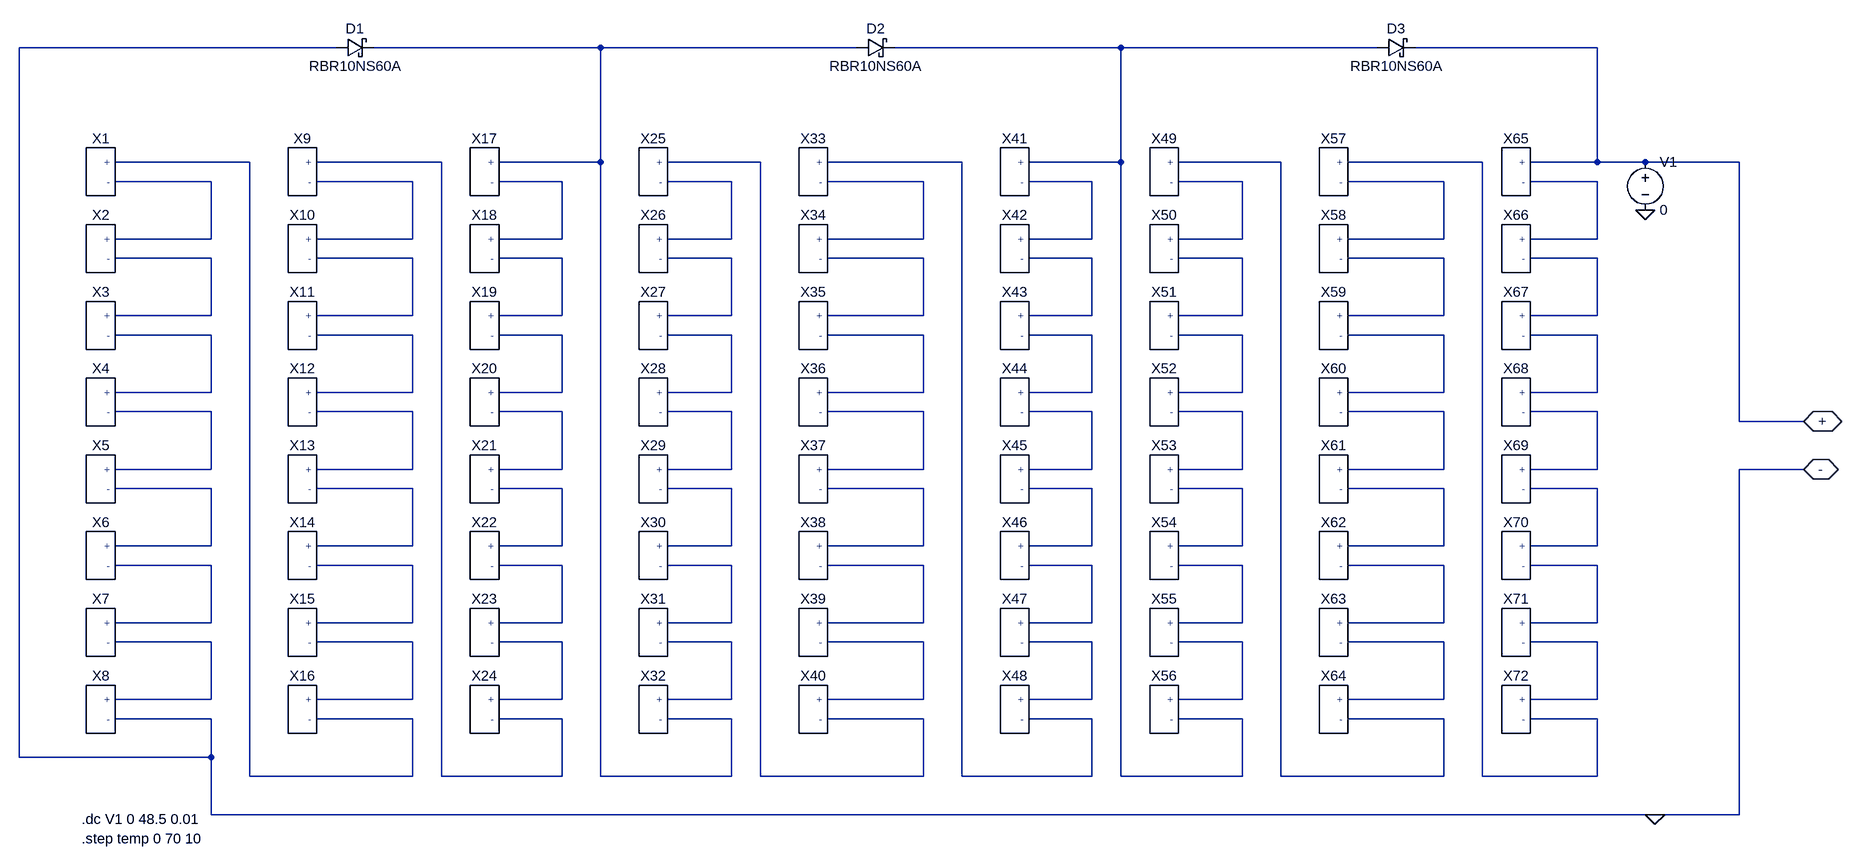
[diagram p0: schematic 24_09_10_Bomen_Module_no_shaded.asc]
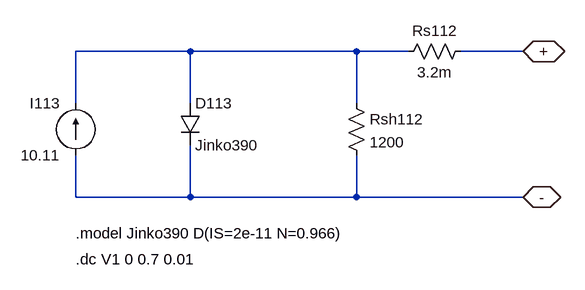
[diagram p1: sub-circuit 24_09_10_bomen_cell.asc]
24_09_10_Bomen_Module_no_shaded.asc, the LTspice schematic file:
Version 4.1
SHEET 1 3316 1452
WIRE 496 -64 -32 -64
WIRE 992 -64 560 -64
WIRE 1472 -64 992 -64
WIRE 1968 -64 1536 -64
WIRE 2448 -64 1968 -64
WIRE 2864 -64 2512 -64
WIRE 352 144 128 144
WIRE 672 144 464 144
WIRE 992 144 992 -64
WIRE 992 144 768 144
WIRE 1312 144 1104 144
WIRE 1648 144 1424 144
WIRE 1968 144 1968 -64
WIRE 1968 144 1760 144
WIRE 2288 144 2064 144
WIRE 2624 144 2400 144
WIRE 2864 144 2864 -64
WIRE 2864 144 2704 144
WIRE 2944 144 2864 144
WIRE 3104 144 2944 144
WIRE 288 176 128 176
WIRE 624 176 464 176
WIRE 928 176 768 176
WIRE 1264 176 1104 176
WIRE 1584 176 1424 176
WIRE 1920 176 1760 176
WIRE 2224 176 2064 176
WIRE 2560 176 2400 176
WIRE 2864 176 2704 176
WIRE 288 272 288 176
WIRE 288 272 128 272
WIRE 624 272 624 176
WIRE 624 272 464 272
WIRE 928 272 928 176
WIRE 928 272 768 272
WIRE 1264 272 1264 176
WIRE 1264 272 1104 272
WIRE 1584 272 1584 176
WIRE 1584 272 1424 272
WIRE 1920 272 1920 176
WIRE 1920 272 1760 272
WIRE 2224 272 2224 176
WIRE 2224 272 2064 272
WIRE 2560 272 2560 176
WIRE 2560 272 2400 272
WIRE 2864 272 2864 176
WIRE 2864 272 2704 272
WIRE 288 304 128 304
WIRE 624 304 464 304
WIRE 928 304 768 304
WIRE 1264 304 1104 304
WIRE 1584 304 1424 304
WIRE 1920 304 1760 304
WIRE 2224 304 2064 304
WIRE 2560 304 2400 304
WIRE 2864 304 2704 304
WIRE 288 400 288 304
WIRE 288 400 128 400
WIRE 624 400 624 304
WIRE 624 400 464 400
WIRE 928 400 928 304
WIRE 928 400 768 400
WIRE 1264 400 1264 304
WIRE 1264 400 1104 400
WIRE 1584 400 1584 304
WIRE 1584 400 1424 400
WIRE 1920 400 1920 304
WIRE 1920 400 1760 400
WIRE 2224 400 2224 304
WIRE 2224 400 2064 400
WIRE 2560 400 2560 304
WIRE 2560 400 2400 400
WIRE 2864 400 2864 304
WIRE 2864 400 2704 400
WIRE 288 432 128 432
WIRE 624 432 464 432
WIRE 928 432 768 432
WIRE 1264 432 1104 432
WIRE 1584 432 1424 432
WIRE 1920 432 1760 432
WIRE 2224 432 2064 432
WIRE 2560 432 2400 432
WIRE 2864 432 2704 432
WIRE 288 528 288 432
WIRE 288 528 128 528
WIRE 624 528 624 432
WIRE 624 528 464 528
WIRE 928 528 928 432
WIRE 928 528 768 528
WIRE 1264 528 1264 432
WIRE 1264 528 1104 528
WIRE 1584 528 1584 432
WIRE 1584 528 1424 528
WIRE 1920 528 1920 432
WIRE 1920 528 1760 528
WIRE 2224 528 2224 432
WIRE 2224 528 2064 528
WIRE 2560 528 2560 432
WIRE 2560 528 2400 528
WIRE 2864 528 2864 432
WIRE 2864 528 2704 528
WIRE 288 560 128 560
WIRE 624 560 464 560
WIRE 928 560 768 560
WIRE 1264 560 1104 560
WIRE 1584 560 1424 560
WIRE 1920 560 1760 560
WIRE 2224 560 2064 560
WIRE 2560 560 2400 560
WIRE 2864 560 2704 560
WIRE 3104 576 3104 144
WIRE 3216 576 3104 576
WIRE 288 656 288 560
WIRE 288 656 128 656
WIRE 624 656 624 560
WIRE 624 656 464 656
WIRE 928 656 928 560
WIRE 928 656 768 656
WIRE 1264 656 1264 560
WIRE 1264 656 1104 656
WIRE 1584 656 1584 560
WIRE 1584 656 1424 656
WIRE 1920 656 1920 560
WIRE 1920 656 1760 656
WIRE 2224 656 2224 560
WIRE 2224 656 2064 656
WIRE 2560 656 2560 560
WIRE 2560 656 2400 656
WIRE 2864 656 2864 560
WIRE 2864 656 2704 656
WIRE 3216 656 3104 656
WIRE 288 688 128 688
WIRE 624 688 464 688
WIRE 928 688 768 688
WIRE 1264 688 1104 688
WIRE 1584 688 1424 688
WIRE 1920 688 1760 688
WIRE 2224 688 2064 688
WIRE 2560 688 2400 688
WIRE 2864 688 2704 688
WIRE 288 784 288 688
WIRE 288 784 128 784
WIRE 624 784 624 688
WIRE 624 784 464 784
WIRE 928 784 928 688
WIRE 928 784 768 784
WIRE 1264 784 1264 688
WIRE 1264 784 1104 784
WIRE 1584 784 1584 688
WIRE 1584 784 1424 784
WIRE 1920 784 1920 688
WIRE 1920 784 1760 784
WIRE 2224 784 2224 688
WIRE 2224 784 2064 784
WIRE 2560 784 2560 688
WIRE 2560 784 2400 784
WIRE 2864 784 2864 688
WIRE 2864 784 2704 784
WIRE 288 816 128 816
WIRE 624 816 464 816
WIRE 928 816 768 816
WIRE 1264 816 1104 816
WIRE 1584 816 1424 816
WIRE 1920 816 1760 816
WIRE 2224 816 2064 816
WIRE 2560 816 2400 816
WIRE 2864 816 2704 816
WIRE 288 912 288 816
WIRE 288 912 128 912
WIRE 624 912 624 816
WIRE 624 912 464 912
WIRE 928 912 928 816
WIRE 928 912 768 912
WIRE 1264 912 1264 816
WIRE 1264 912 1104 912
WIRE 1584 912 1584 816
WIRE 1584 912 1424 912
WIRE 1920 912 1920 816
WIRE 1920 912 1760 912
WIRE 2224 912 2224 816
WIRE 2224 912 2064 912
WIRE 2560 912 2560 816
WIRE 2560 912 2400 912
WIRE 2864 912 2864 816
WIRE 2864 912 2704 912
WIRE 288 944 128 944
WIRE 624 944 464 944
WIRE 928 944 768 944
WIRE 1264 944 1104 944
WIRE 1584 944 1424 944
WIRE 1920 944 1760 944
WIRE 2224 944 2064 944
WIRE 2560 944 2400 944
WIRE 2864 944 2704 944
WIRE 288 1040 288 944
WIRE 288 1040 128 1040
WIRE 624 1040 624 944
WIRE 624 1040 464 1040
WIRE 928 1040 928 944
WIRE 928 1040 768 1040
WIRE 1264 1040 1264 944
WIRE 1264 1040 1104 1040
WIRE 1584 1040 1584 944
WIRE 1584 1040 1424 1040
WIRE 1920 1040 1920 944
WIRE 1920 1040 1760 1040
WIRE 2224 1040 2224 944
WIRE 2224 1040 2064 1040
WIRE 2560 1040 2560 944
WIRE 2560 1040 2400 1040
WIRE 2864 1040 2864 944
WIRE 2864 1040 2704 1040
WIRE 288 1072 128 1072
WIRE 624 1072 464 1072
WIRE 928 1072 768 1072
WIRE 1264 1072 1104 1072
WIRE 1584 1072 1424 1072
WIRE 1920 1072 1760 1072
WIRE 2224 1072 2064 1072
WIRE 2560 1072 2400 1072
WIRE 2864 1072 2704 1072
WIRE -32 1136 -32 -64
WIRE 288 1136 288 1072
WIRE 288 1136 -32 1136
WIRE 352 1168 352 144
WIRE 624 1168 624 1072
WIRE 624 1168 352 1168
WIRE 672 1168 672 144
WIRE 928 1168 928 1072
WIRE 928 1168 672 1168
WIRE 992 1168 992 144
WIRE 1264 1168 1264 1072
WIRE 1264 1168 992 1168
WIRE 1312 1168 1312 144
WIRE 1584 1168 1584 1072
WIRE 1584 1168 1312 1168
WIRE 1648 1168 1648 144
WIRE 1920 1168 1920 1072
WIRE 1920 1168 1648 1168
WIRE 1968 1168 1968 144
WIRE 2224 1168 2224 1072
WIRE 2224 1168 1968 1168
WIRE 2288 1168 2288 144
WIRE 2560 1168 2560 1072
WIRE 2560 1168 2288 1168
WIRE 2624 1168 2624 144
WIRE 2864 1168 2864 1072
WIRE 2864 1168 2624 1168
WIRE 288 1232 288 1136
WIRE 2960 1232 288 1232
WIRE 3104 1232 3104 656
WIRE 3104 1232 2960 1232
FLAG 3216 576 +
IOPIN 3216 576 BiDir
FLAG 3216 656 -
IOPIN 3216 656 BiDir
FLAG 2944 224 0
FLAG 2960 1232 0
SYMBOL 24_09_10_Bomen_Cell 96 160 R0
SYMATTR InstName X1
SYMBOL 24_09_10_Bomen_Cell 96 288 R0
SYMATTR InstName X2
SYMBOL 24_09_10_Bomen_Cell 96 416 R0
SYMATTR InstName X3
SYMBOL 24_09_10_Bomen_Cell 96 544 R0
SYMATTR InstName X4
SYMBOL 24_09_10_Bomen_Cell 96 672 R0
SYMATTR InstName X5
SYMBOL 24_09_10_Bomen_Cell 96 800 R0
SYMATTR InstName X6
SYMBOL 24_09_10_Bomen_Cell 96 928 R0
SYMATTR InstName X7
SYMBOL 24_09_10_Bomen_Cell 96 1056 R0
SYMATTR InstName X8
SYMBOL 24_09_10_Bomen_Cell 432 160 R0
SYMATTR InstName X9
SYMBOL 24_09_10_Bomen_Cell 432 288 R0
SYMATTR InstName X10
SYMBOL 24_09_10_Bomen_Cell 432 416 R0
SYMATTR InstName X11
SYMBOL 24_09_10_Bomen_Cell 432 544 R0
SYMATTR InstName X12
SYMBOL 24_09_10_Bomen_Cell 432 672 R0
SYMATTR InstName X13
SYMBOL 24_09_10_Bomen_Cell 432 800 R0
SYMATTR InstName X14
SYMBOL 24_09_10_Bomen_Cell 432 928 R0
SYMATTR InstName X15
SYMBOL 24_09_10_Bomen_Cell 432 1056 R0
SYMATTR InstName X16
SYMBOL 24_09_10_Bomen_Cell 736 160 R0
SYMATTR InstName X17
SYMBOL 24_09_10_Bomen_Cell 736 288 R0
SYMATTR InstName X18
SYMBOL 24_09_10_Bomen_Cell 736 416 R0
SYMATTR InstName X19
SYMBOL 24_09_10_Bomen_Cell 736 544 R0
SYMATTR InstName X20
SYMBOL 24_09_10_Bomen_Cell 736 672 R0
SYMATTR InstName X21
SYMBOL 24_09_10_Bomen_Cell 736 800 R0
SYMATTR InstName X22
SYMBOL 24_09_10_Bomen_Cell 736 928 R0
SYMATTR InstName X23
SYMBOL 24_09_10_Bomen_Cell 1072 160 R0
SYMATTR InstName X25
SYMBOL 24_09_10_Bomen_Cell 1072 288 R0
SYMATTR InstName X26
SYMBOL 24_09_10_Bomen_Cell 1072 416 R0
SYMATTR InstName X27
SYMBOL 24_09_10_Bomen_Cell 1072 544 R0
SYMATTR InstName X28
SYMBOL 24_09_10_Bomen_Cell 1072 672 R0
SYMATTR InstName X29
SYMBOL 24_09_10_Bomen_Cell 1072 800 R0
SYMATTR InstName X30
SYMBOL 24_09_10_Bomen_Cell 1072 928 R0
SYMATTR InstName X31
SYMBOL 24_09_10_Bomen_Cell 1072 1056 R0
SYMATTR InstName X32
SYMBOL 24_09_10_Bomen_Cell 1392 160 R0
SYMATTR InstName X33
SYMBOL 24_09_10_Bomen_Cell 1392 288 R0
SYMATTR InstName X34
SYMBOL 24_09_10_Bomen_Cell 1392 416 R0
SYMATTR InstName X35
SYMBOL 24_09_10_Bomen_Cell 1392 544 R0
SYMATTR InstName X36
SYMBOL 24_09_10_Bomen_Cell 1392 672 R0
SYMATTR InstName X37
SYMBOL 24_09_10_Bomen_Cell 1392 800 R0
SYMATTR InstName X38
SYMBOL 24_09_10_Bomen_Cell 1392 928 R0
SYMATTR InstName X39
SYMBOL 24_09_10_Bomen_Cell 1392 1056 R0
SYMATTR InstName X40
SYMBOL 24_09_10_Bomen_Cell 1728 160 R0
SYMATTR InstName X41
SYMBOL 24_09_10_Bomen_Cell 1728 288 R0
SYMATTR InstName X42
SYMBOL 24_09_10_Bomen_Cell 1728 416 R0
SYMATTR InstName X43
SYMBOL 24_09_10_Bomen_Cell 1728 544 R0
SYMATTR InstName X44
SYMBOL 24_09_10_Bomen_Cell 1728 672 R0
SYMATTR InstName X45
SYMBOL 24_09_10_Bomen_Cell 1728 800 R0
SYMATTR InstName X46
SYMBOL 24_09_10_Bomen_Cell 1728 928 R0
SYMATTR InstName X47
SYMBOL 24_09_10_Bomen_Cell 2032 160 R0
SYMATTR InstName X49
SYMBOL 24_09_10_Bomen_Cell 2032 288 R0
SYMATTR InstName X50
SYMBOL 24_09_10_Bomen_Cell 2032 416 R0
SYMATTR InstName X51
SYMBOL 24_09_10_Bomen_Cell 2032 544 R0
SYMATTR InstName X52
SYMBOL 24_09_10_Bomen_Cell 2032 672 R0
SYMATTR InstName X53
SYMBOL 24_09_10_Bomen_Cell 2032 800 R0
SYMATTR InstName X54
SYMBOL 24_09_10_Bomen_Cell 2032 928 R0
SYMATTR InstName X55
SYMBOL 24_09_10_Bomen_Cell 2032 1056 R0
SYMATTR InstName X56
SYMBOL 24_09_10_Bomen_Cell 2368 160 R0
SYMATTR InstName X57
SYMBOL 24_09_10_Bomen_Cell 2368 288 R0
SYMATTR InstName X58
SYMBOL 24_09_10_Bomen_Cell 2368 416 R0
SYMATTR InstName X59
SYMBOL 24_09_10_Bomen_Cell 2368 544 R0
SYMATTR InstName X60
SYMBOL 24_09_10_Bomen_Cell 2368 672 R0
SYMATTR InstName X61
SYMBOL 24_09_10_Bomen_Cell 2368 800 R0
SYMATTR InstName X62
SYMBOL 24_09_10_Bomen_Cell 2368 928 R0
SYMATTR InstName X63
SYMBOL 24_09_10_Bomen_Cell 2368 1056 R0
SYMATTR InstName X64
SYMBOL 24_09_10_Bomen_Cell 2672 160 R0
SYMATTR InstName X65
SYMBOL 24_09_10_Bomen_Cell 2672 288 R0
SYMATTR InstName X66
SYMBOL 24_09_10_Bomen_Cell 2672 416 R0
SYMATTR InstName X67
SYMBOL 24_09_10_Bomen_Cell 2672 544 R0
SYMATTR InstName X68
SYMBOL 24_09_10_Bomen_Cell 2672 672 R0
SYMATTR InstName X69
SYMBOL 24_09_10_Bomen_Cell 2672 800 R0
SYMATTR InstName X70
SYMBOL 24_09_10_Bomen_Cell 2672 928 R0
SYMATTR InstName X71
SYMBOL schottky 496 -48 R270
WINDOW 0 32 32 VTop 2
WINDOW 3 0 32 VBottom 2
SYMATTR InstName D1
SYMATTR Value RBR10NS60A
SYMATTR Description Diode
SYMATTR Type diode
SYMBOL schottky 1472 -48 R270
WINDOW 0 32 32 VTop 2
WINDOW 3 0 32 VBottom 2
SYMATTR InstName D2
SYMATTR Value RBR10NS60A
SYMATTR Description Diode
SYMATTR Type diode
SYMBOL schottky 2448 -48 R270
WINDOW 0 32 32 VTop 2
WINDOW 3 0 32 VBottom 2
SYMATTR InstName D3
SYMATTR Value RBR10NS60A
SYMATTR Description Diode
SYMATTR Type diode
SYMBOL voltage 2944 128 R0
WINDOW 123 0 0 Left 0
WINDOW 39 0 0 Left 0
SYMATTR InstName V1
SYMATTR Value 0
SYMBOL 24_09_10_Bomen_Cell 736 1056 R0
SYMATTR InstName X24
SYMBOL 24_09_10_Bomen_Cell 1728 1056 R0
SYMATTR InstName X48
SYMBOL 24_09_10_Bomen_Cell 2672 1056 R0
SYMATTR InstName X72
TEXT 72 1240 Left 2 !.dc V1 0 48.5 0.01
TEXT 72 1272 Left 2 !.step temp 0 70 10

24_09_10_bomen_cell.asc, the sub-circuit schematic file:
Version 4
SHEET 1 9108 680
WIRE -2000 48 -2176 48
WIRE -1744 48 -2000 48
WIRE -1664 48 -1744 48
WIRE -1488 48 -1584 48
WIRE -2176 128 -2176 48
WIRE -2000 128 -2000 48
WIRE -1744 128 -1744 48
WIRE -2176 272 -2176 208
WIRE -2000 272 -2000 192
WIRE -2000 272 -2176 272
WIRE -1744 272 -1744 208
WIRE -1744 272 -2000 272
WIRE -1488 272 -1744 272
FLAG -1488 272 -
IOPIN -1488 272 BiDir
FLAG -1488 48 +
IOPIN -1488 48 BiDir
SYMBOL diode -2016 128 R0
SYMATTR InstName D113
SYMATTR Value Jinko390
SYMBOL current -2176 208 R180
WINDOW 0 24 80 Left 2
WINDOW 3 24 0 Left 2
WINDOW 123 0 0 Left 0
WINDOW 39 0 0 Left 0
SYMATTR InstName I113
SYMATTR Value 10.11
SYMBOL res -1760 112 R0
SYMATTR InstName Rsh112
SYMATTR Value 1200
SYMBOL res -1680 64 R270
WINDOW 0 32 56 VTop 2
WINDOW 3 0 56 VBottom 2
SYMATTR InstName Rs112
SYMATTR Value 3.2m
TEXT -2176 328 Left 2 !.model Jinko390 D(IS=2e-11 N=0.966)
TEXT -2176 368 Left 2 !.dc V1 0 0.7 0.01

The netlist it stands for:
* 24_09_10_Bomen_Module_no_shaded.asc
X§X1 N003 N009 24_09_10_bomen_cell
X§X2 N009 N018 24_09_10_bomen_cell
X§X3 N018 N027 24_09_10_bomen_cell
X§X4 N027 N036 24_09_10_bomen_cell
X§X5 N036 N045 24_09_10_bomen_cell
X§X6 N045 N054 24_09_10_bomen_cell
X§X7 N054 N063 24_09_10_bomen_cell
X§X8 N063 0 24_09_10_bomen_cell
X§X9 N004 N010 24_09_10_bomen_cell
X§X10 N010 N019 24_09_10_bomen_cell
X§X11 N019 N028 24_09_10_bomen_cell
X§X12 N028 N037 24_09_10_bomen_cell
X§X13 N037 N046 24_09_10_bomen_cell
X§X14 N046 N055 24_09_10_bomen_cell
X§X15 N055 N064 24_09_10_bomen_cell
X§X16 N064 N003 24_09_10_bomen_cell
X§X17 N001 N011 24_09_10_bomen_cell
X§X18 N011 N020 24_09_10_bomen_cell
X§X19 N020 N029 24_09_10_bomen_cell
X§X20 N029 N038 24_09_10_bomen_cell
X§X21 N038 N047 24_09_10_bomen_cell
X§X22 N047 N056 24_09_10_bomen_cell
X§X23 N056 N065 24_09_10_bomen_cell
X§X25 N005 N012 24_09_10_bomen_cell
X§X26 N012 N021 24_09_10_bomen_cell
X§X27 N021 N030 24_09_10_bomen_cell
X§X28 N030 N039 24_09_10_bomen_cell
X§X29 N039 N048 24_09_10_bomen_cell
X§X30 N048 N057 24_09_10_bomen_cell
X§X31 N057 N066 24_09_10_bomen_cell
X§X32 N066 N001 24_09_10_bomen_cell
X§X33 N006 N013 24_09_10_bomen_cell
X§X34 N013 N022 24_09_10_bomen_cell
X§X35 N022 N031 24_09_10_bomen_cell
X§X36 N031 N040 24_09_10_bomen_cell
X§X37 N040 N049 24_09_10_bomen_cell
X§X38 N049 N058 24_09_10_bomen_cell
X§X39 N058 N067 24_09_10_bomen_cell
X§X40 N067 N005 24_09_10_bomen_cell
X§X41 N002 N014 24_09_10_bomen_cell
X§X42 N014 N023 24_09_10_bomen_cell
X§X43 N023 N032 24_09_10_bomen_cell
X§X44 N032 N041 24_09_10_bomen_cell
X§X45 N041 N050 24_09_10_bomen_cell
X§X46 N050 N059 24_09_10_bomen_cell
X§X47 N059 N068 24_09_10_bomen_cell
X§X49 N007 N015 24_09_10_bomen_cell
X§X50 N015 N024 24_09_10_bomen_cell
X§X51 N024 N033 24_09_10_bomen_cell
X§X52 N033 N042 24_09_10_bomen_cell
X§X53 N042 N051 24_09_10_bomen_cell
X§X54 N051 N060 24_09_10_bomen_cell
X§X55 N060 N069 24_09_10_bomen_cell
X§X56 N069 N002 24_09_10_bomen_cell
X§X57 N008 N016 24_09_10_bomen_cell
X§X58 N016 N025 24_09_10_bomen_cell
X§X59 N025 N034 24_09_10_bomen_cell
X§X60 N034 N043 24_09_10_bomen_cell
X§X61 N043 N052 24_09_10_bomen_cell
X§X62 N052 N061 24_09_10_bomen_cell
X§X63 N061 N070 24_09_10_bomen_cell
X§X64 N070 N007 24_09_10_bomen_cell
X§X65 + N017 24_09_10_bomen_cell
X§X66 N017 N026 24_09_10_bomen_cell
X§X67 N026 N035 24_09_10_bomen_cell
X§X68 N035 N044 24_09_10_bomen_cell
X§X69 N044 N053 24_09_10_bomen_cell
X§X70 N053 N062 24_09_10_bomen_cell
X§X71 N062 N071 24_09_10_bomen_cell
D1 0 N001 RBR10NS60A
D2 N001 N002 RBR10NS60A
D3 N002 + RBR10NS60A
V1 + 0 0
X§X24 N065 N004 24_09_10_bomen_cell
X§X48 N068 N006 24_09_10_bomen_cell
X§X72 N071 N008 24_09_10_bomen_cell

* block symbol definitions
.subckt 24_09_10_bomen_cell + -
D113 N001 - Jinko390
I113 - N001 10.11
Rsh112 N001 - 1200
Rs112 N001 + 3.2m
.model Jinko390 D(IS=2e-11 N=0.966)
.dc V1 0 0.7 0.01
.ends 24_09_10_bomen_cell

.model D D
.lib standard.dio
.dc V1 0 48.5 0.01
.step temp 0 70 10
.backanno
.end